# Altium project BrewConEnd1.PrjPcb
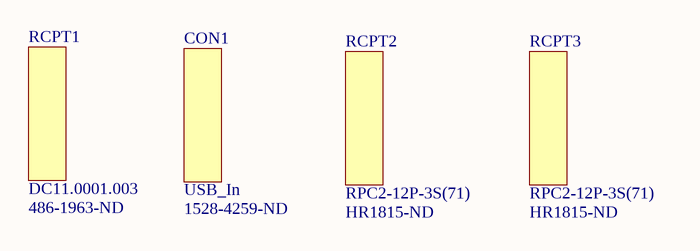
[diagram p0: EndCap1.SchDoc]
1 sheet, 4 parts. Net scope: global (net labels, ports and power ports of the same name join across sheets).
Board file: EndCap1.PcbDoc

## Sheet EndCap1.SchDoc
size A4

### Parts
CON1  USB_In  Supplier Part Number 1: 1528-4259-ND  [Ada4259]
RCPT1  DC11.0001.003  Supplier Part Number 1: 486-1963-ND  [DC11.0001.003]
RCPT2  RPC2-12P-3S(71)  Supplier Part Number 1: HR1815-ND  [RPC2-12RB-3P(71)]
RCPT3  RPC2-12P-3S(71)  Supplier Part Number 1: HR1815-ND  [RPC2-12RB-3P(71)]

### Library data of the parts
CON1 = USB_In: Panel mount mains output socket; Manufacturer: Adafruit Industries; Manufacturer Part Number: 4259; Supplier 1: Digi-Key; RoHS: No; Stock 1: 132
RCPT1 = DC11.0001.003: Plug C14 Faston 4.8 x 0.8 mm 10 A/250 VAC black Screw mounting L + N + PE, DC11.0001.003, Schurter; Number of Contacts: 3; Max Voltage Rating (AC): 250V; Current Rating: 12A; Gender: Male; Fuse: No; Connector Type: Receptacle; Number of Ports: 1; Throw Configuration: SPST; Ratings: IP40; Approvals: cULus,ENEC,CCC; Supplier 1: Digi-Key; Manufacturer: Schurter; Manufacturer Part Number: DC11.0001.003; RoHS: Yes; Category: Power Connectors; Stock 1: 1159; Mount: Panel,Flanges,Screw,Snap in; Case/Package: Module; Weight: 0.599657oz; Housing Material: Thermoplastic; Color: Black; Min Operating Temperature: -25°C; Max Operating Temperature: 70°C; Termination: Quick Connect; Voltage Rating (AC): 250V; Orientation: Straight; Number of Positions: 3; Current: 12A; Voltage: 250V; Package Quantity: 50; Voltage Rating: 250V; Voltage Rating (DC): 250V; Max Current Rating: 12A; Packaging: Bulk; Number of Poles: 1; Type: Switch; Length: 44mm; Depth: 36.5mm; Radiation Hardening: No; REACH SVHC: No SVHC; Flammability Rating: UL94 V-0; Lead Free: Lead Free; ComponentLink1URL: https://datasheet.ciiva.com/6926/typ-dc11-6926800.pdf?src-supplier=Digi-Key; ComponentLink1Description: https://datasheet.ciiva.com/6926/typ-dc11-6926800.pdf?src-supplier=Digi-Key; ComponentLink2URL: https://datasheet.ciiva.com/11728/0900766b8050470e-11728225.pdf?src-supplier=RSComponents; ComponentLink2Description: https://datasheet.ciiva.com/11728/0900766b8050470e-11728225.pdf?src-supplier=RSComponents; ComponentLink3URL: https://datasheet.ciiva.com/16089/57typ-wire-harness-16089619.pdf?src-supplier=Onlinecomponents.com; ComponentLink3Description: https://datasheet.ciiva.com/16089/57typ-wire-harness-16089619.pdf?src-supplier=Onlinecomponents.com; ComponentLink4URL: https://datasheet.ciiva.com/3147/typ-wire-harness-3147526.pdf?src-supplier=Avnet; ComponentLink4Description: https://datasheet.ciiva.com/3147/typ-wire-harness-3147526.pdf?src-supplier=Avnet; ComponentLink5URL: https://datasheet.ciiva.com/3345/zjdc11-data-e-3345370.pdf?src-supplier=Distrelec; ComponentLink5Description: https://datasheet.ciiva.com/3345/zjdc11-data-e-3345370.pdf?src-supplier=Distrelec; ComponentLink6URL: https://datasheet.ciiva.com/16645/typ-wire-harness-16645711.pdf?src-supplier=Avnet+Europe; ComponentLink6Description: https://datasheet.ciiva.com/16645/typ-wire-harness-16645711.pdf?src-supplier=Avnet+Europe; ComponentLink7URL: https://datasheet.ciiva.com/14570/70080071-14570935.pdf?src-supplier=Allied+Electronics; ComponentLink7Description: https://datasheet.ciiva.com/14570/70080071-14570935.pdf?src-supplier=Allied+Electronics; ComponentLink8URL: https://datasheet.ciiva.com/30127/typ-dc11-30127048.pdf?src-supplier=Onlinecomponents.com; ComponentLink8Description: https://datasheet.ciiva.com/30127/typ-dc11-30127048.pdf?src-supplier=Onlinecomponents.com; ComponentLink9URL: https://datasheet.ciiva.com/16346/typ-dc11-16346954.pdf?src-supplier=Future+Electronics; ComponentLink9Description: https://datasheet.ciiva.com/16346/typ-dc11-16346954.pdf?src-supplier=Future+Electronics; ComponentLink10URL: https://datasheet.ciiva.com/4582/typ-dc11-4582700.pdf?src-supplier=Mouser; ComponentLink10Description: https://datasheet.ciiva.com/4582/typ-dc11-4582700.pdf?src-supplier=Mouser; ComponentLink11URL: https://datasheet.ciiva.com/8067/1712870-8067007.pdf?src-supplier=Element14; ComponentLink11Description: https://datasheet.ciiva.com/8067/1712870-8067007.pdf?src-supplier=Element14
RCPT2 RCPT3 = RPC2-12P-3S(71): CONN PLUG 3 POS W/SOCKETS; Manufacturer: Hirose; Number of Positions: 3; Voltage Rating: 250V; Current Rating: 5A; Supplier 1: Digi-Key; Manufacturer Part Number: RPC2-12P-3S(71); RoHS: Yes; Category: Circular Connectors; Stock 1: 1316; Mount: Free Hanging,Cable; Color: Blue; Contact Plating: Silver; Contact Material: Bronze; Insulation Material: Plastic; Shell Material: Plastic; Min Operating Temperature: -10°C; Max Operating Temperature: 60°C; Termination: Solder; Orientation: Straight; Package Quantity: 50; Fastening Type: Push,Pull; Packaging: Tray; Connector Type: Plug; Number of Contacts: 3; Contact Gender: Female; Radiation Hardening: No; Lead Free: Lead Free; ComponentLink1URL: https://datasheet.ciiva.com/549/e11300018-549107.pdf?src-supplier=Digi-Key; ComponentLink1Description: https://datasheet.ciiva.com/549/e11300018-549107.pdf?src-supplier=Digi-Key; ComponentLink2URL: https://datasheet.ciiva.com/3103/e11300018-3103307.pdf?src-supplier=Avnet; ComponentLink2Description: https://datasheet.ciiva.com/3103/e11300018-3103307.pdf?src-supplier=Avnet; ComponentLink3URL: https://datasheet.ciiva.com/16752/e11300018-16752447.pdf?src-supplier=Avnet+Europe; ComponentLink3Description: https://datasheet.ciiva.com/16752/e11300018-16752447.pdf?src-supplier=Avnet+Europe